# Altium schematic sheet 电子脚铐手持式主控板_Key.SchDoc
size A4
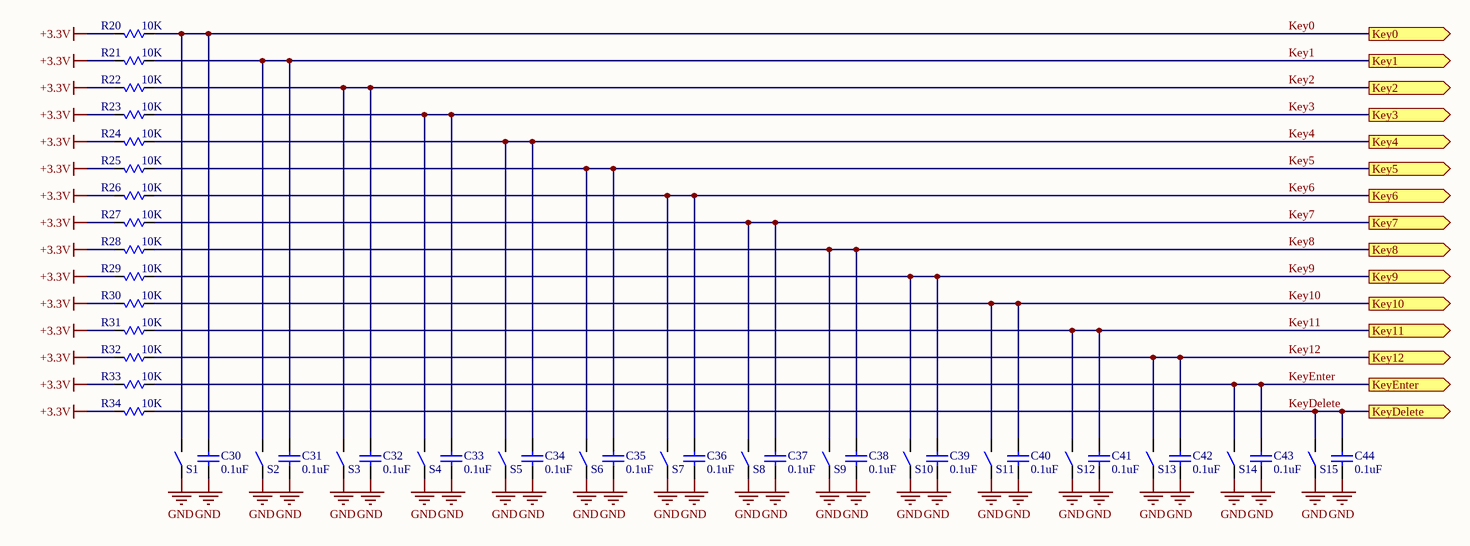
[diagram p0: 电子脚铐手持式主控板_Key.SchDoc]

## Parts
C30  0.1uF  [C0603]
C31  0.1uF  [C0603]
C32  0.1uF  [C0603]
C33  0.1uF  [C0603]
C34  0.1uF  [C0603]
C35  0.1uF  [C0603]
C36  0.1uF  [C0603]
C37  0.1uF  [C0603]
C38  0.1uF  [C0603]
C39  0.1uF  [C0603]
C40  0.1uF  [C0603]
C41  0.1uF  [C0603]
C42  0.1uF  [C0603]
C43  0.1uF  [C0603]
C44  0.1uF  [C0603]
R20  10K  [R0603]
R21  10K  [R0603]
R22  10K  [R0603]
R23  10K  [R0603]
R24  10K  [R0603]
R25  10K  [R0603]
R26  10K  [R0603]
R27  10K  [R0603]
R28  10K  [R0603]
R29  10K  [R0603]
R30  10K  [R0603]
R31  10K  [R0603]
R32  10K  [R0603]
R33  10K  [R0603]
R34  10K  [R0603]
S1  Switch  [B3F-4055]  (value not drawn)
S2  Switch  [B3F-4055]  (value not drawn)
S3  Switch  [B3F-4055]  (value not drawn)
S4  Switch  [B3F-4055]  (value not drawn)
S5  Switch  [B3F-4055]  (value not drawn)
S6  Switch  [B3F-4055]  (value not drawn)
S7  Switch  [B3F-4055]  (value not drawn)
S8  Switch  [B3F-4055]  (value not drawn)
S9  Switch  [B3F-4055]  (value not drawn)
S10  Switch  [B3F-4055]  (value not drawn)
S11  Switch  [B3F-4055]  (value not drawn)
S12  Switch  [B3F-4055]  (value not drawn)
S13  Switch  [B3F-4055]  (value not drawn)
S14  Switch  [B3F-4055]  (value not drawn)
S15  Switch  [B3F-4055]  (value not drawn)

## Ports
Key0 (out), Key1 (out), Key2 (out), Key3 (out), Key4 (out), Key5 (out), Key6 (out), Key7 (out), Key8 (out), Key9 (out), Key10 (out), Key11 (out), Key12 (out), KeyDelete (out), KeyEnter (out)

## Nets
+3.3V: R20.2 R21.2 R22.2 R23.2 R24.2 R25.2 R26.2 R27.2 R28.2 R29.2 R30.2 R31.2 R32.2 R33.2 R34.2
GND: C30.2 C31.2 C32.2 C33.2 C34.2 C35.2 C36.2 C37.2 C38.2 C39.2 C40.2 C41.2 C42.2 C43.2 C44.2 S1.1 S2.1 S3.1 S4.1 S5.1 S6.1 S7.1 S8.1 S9.1 S10.1 S11.1 S12.1 S13.1 S14.1 S15.1
Key0: C30.1 R20.1 S1.2 ; port Key0
Key1: C31.1 R21.1 S2.2 ; port Key1
Key2: C32.1 R22.1 S3.2 ; port Key2
Key3: C33.1 R23.1 S4.2 ; port Key3
Key4: C34.1 R24.1 S5.2 ; port Key4
Key5: C35.1 R25.1 S6.2 ; port Key5
Key6: C36.1 R26.1 S7.2 ; port Key6
Key7: C37.1 R27.1 S8.2 ; port Key7
Key8: C38.1 R28.1 S9.2 ; port Key8
Key9: C39.1 R29.1 S10.2 ; port Key9
Key10: C40.1 R30.1 S11.2 ; port Key10
Key11: C41.1 R31.1 S12.2 ; port Key11
Key12: C42.1 R32.1 S13.2 ; port Key12
KeyDelete: C44.1 R34.1 S15.2 ; port KeyDelete
KeyEnter: C43.1 R33.1 S14.2 ; port KeyEnter

## Notes on the sheet
- 文件名:
- 审核:
- 制图人:
- 孟浩
- 校对:
- 图号:
- 批准:
- 日期:

## Library data of the parts
C30-C44 = Cap: Capacitor; Published: 8-Jun-2000; Revision: July-2002: Re-released for DXP Platform.; Publisher: Altium Limited
R20-R34 = RES: Resistor; Published: 8-Jun-2000; LatestRevisionDate: 17-Jul-2002; LatestRevisionNote: Re-released for DXP Platform.; PackageReference: AXIAL-0.3; Publisher: Altium Limited
S1-S15 = Sw